# EAGLE schematic milliLearn-ice40 (EAGLE 9.5.1)

## Sheet 1 of 4
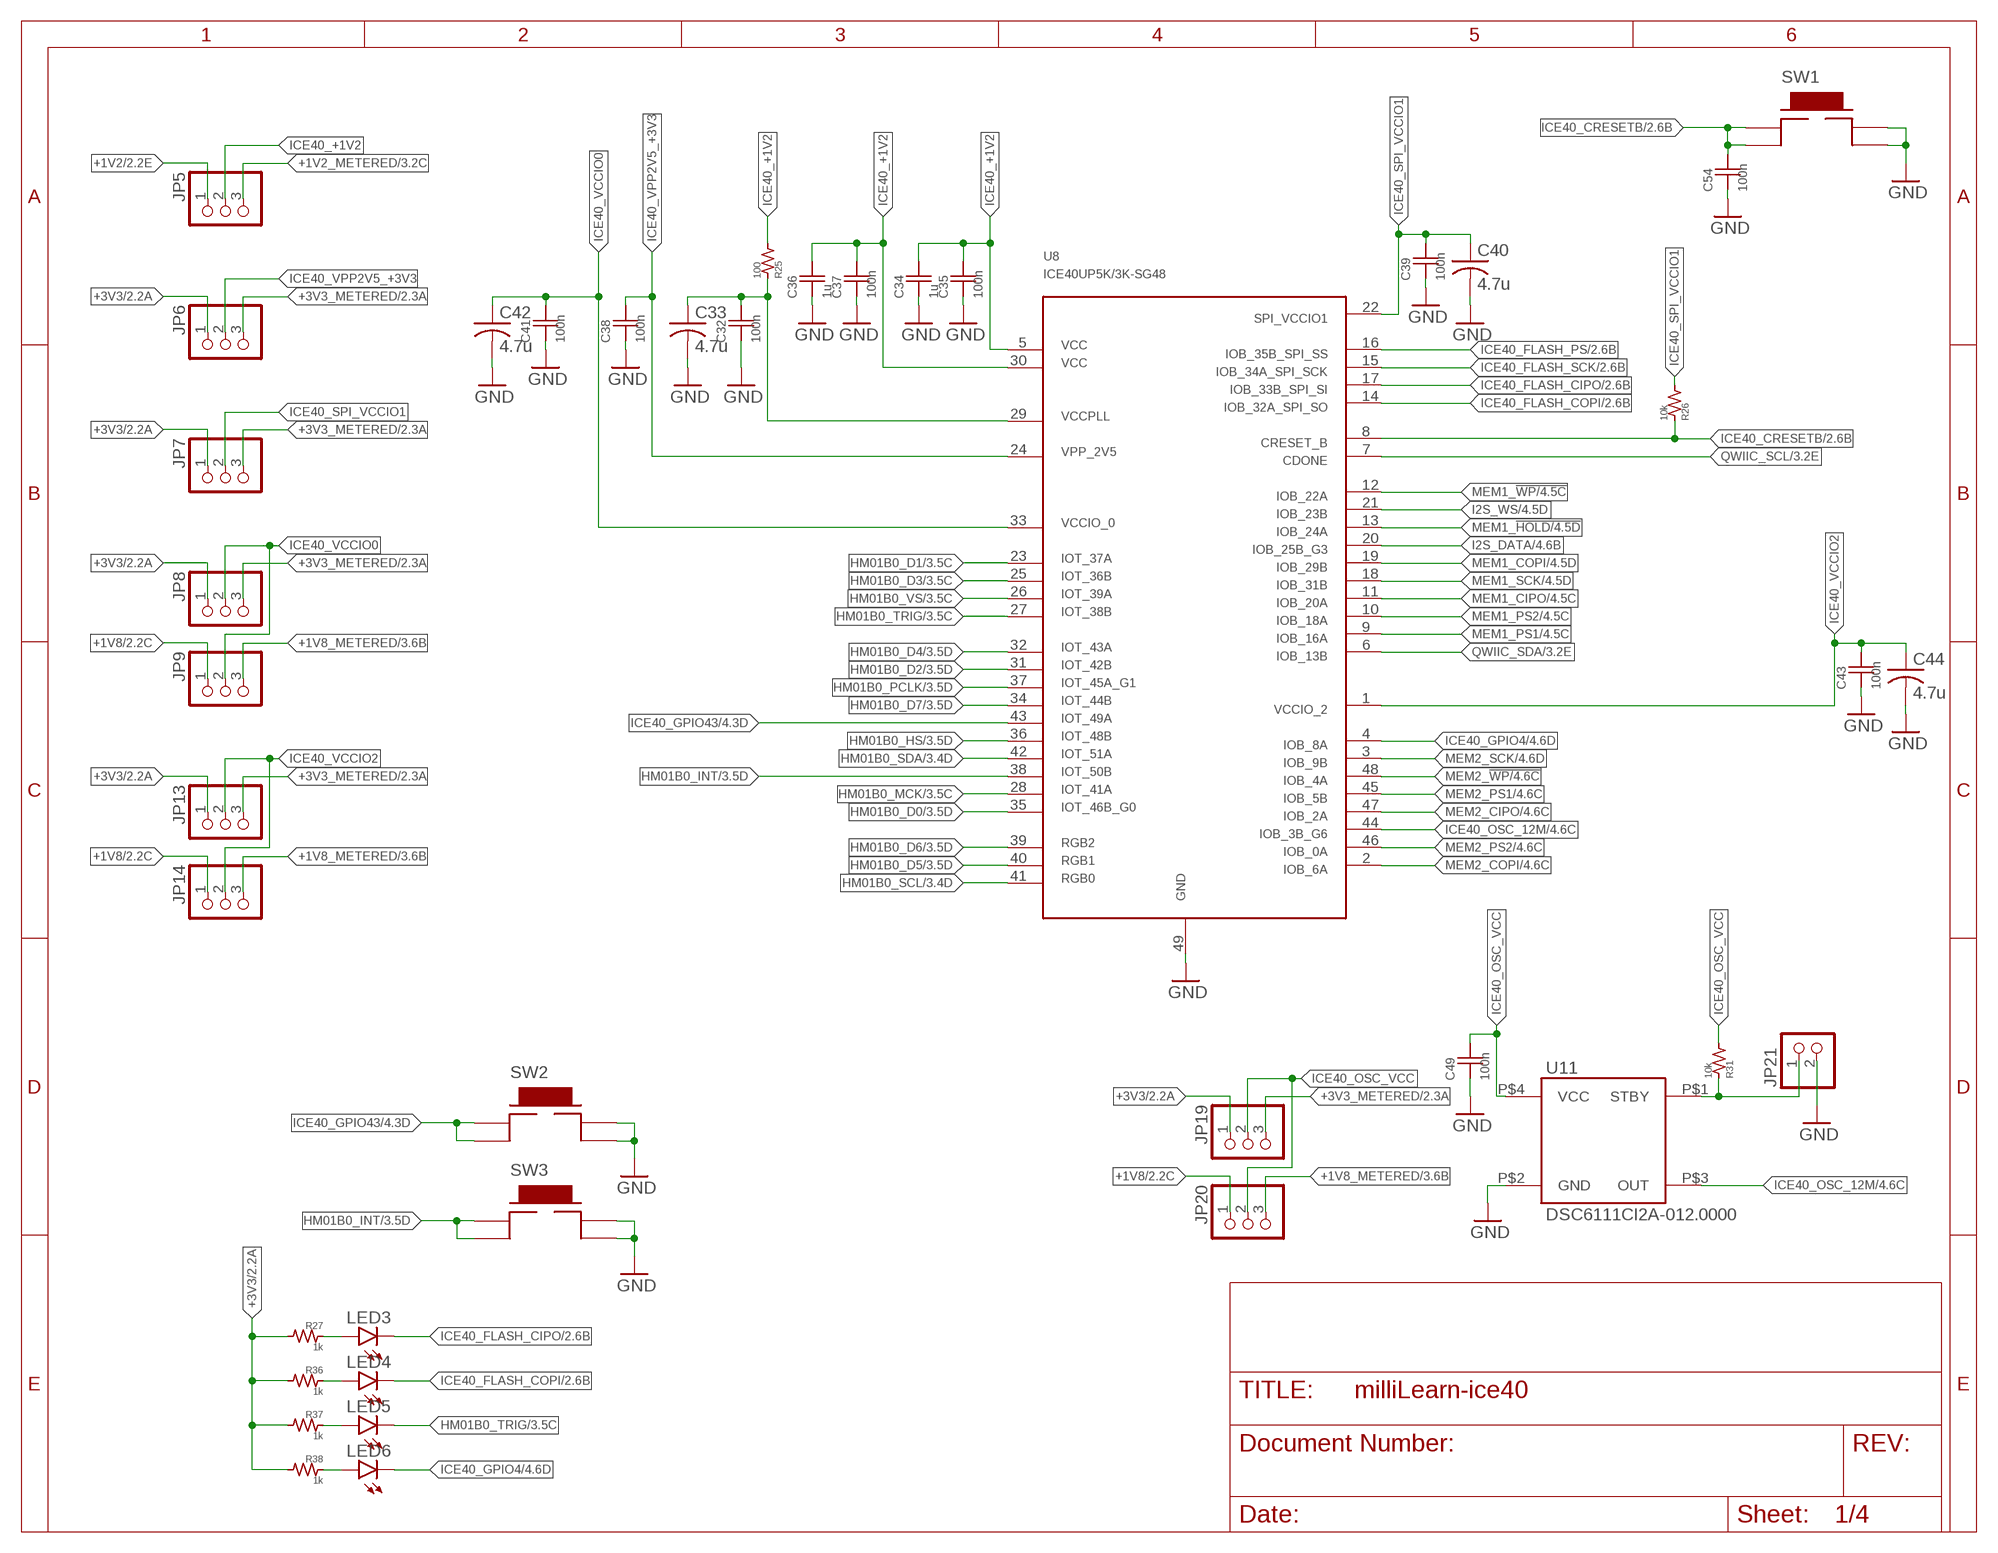
[diagram p0: schematic, sheet 1]

### Parts
C32  100n  C0402_COMPACT  [C0402_COMPACT]
C33  4.7u  C-USC0603  [C0603]
C34  1u  C0402_COMPACT  [C0402_COMPACT]
C35  100n  C0402_COMPACT  [C0402_COMPACT]
C36  1u  C0402_COMPACT  [C0402_COMPACT]
C37  100n  C0402_COMPACT  [C0402_COMPACT]
C38  100n  C0402_COMPACT  [C0402_COMPACT]
C39  100n  C0402_COMPACT  [C0402_COMPACT]
C40  4.7u  C-USC0603  [C0603]
C41  100n  C0402_COMPACT  [C0402_COMPACT]
C42  4.7u  C-USC0603  [C0603]
C43  100n  C0402_COMPACT  [C0402_COMPACT]
C44  4.7u  C-USC0603  [C0603]
C49  100n  C0402_COMPACT  [C0402_COMPACT]
C54  100n  C0402_COMPACT  [C0402_COMPACT]
JP5  PINHD-1X3  [1X03]
JP6  PINHD-1X3  [1X03]
JP7  PINHD-1X3  [1X03]
JP8  PINHD-1X3  [1X03]
JP9  PINHD-1X3  [1X03]
JP13  PINHD-1X3  [1X03]
JP14  PINHD-1X3  [1X03]
JP19  PINHD-1X3  [1X03]
JP20  PINHD-1X3  [1X03]
JP21  PINHD-1X2  [1X02]
LED3  LEDCHIPLED_0603  [CHIPLED_0603]
LED4  LEDCHIPLED_0603  [CHIPLED_0603]
LED5  LEDCHIPLED_0603  [CHIPLED_0603]
LED6  LEDCHIPLED_0603  [CHIPLED_0603]
R25  100  R0402_COMPACT  [R0402_COMPACT]
R26  10k  R0402_COMPACT  [R0402_COMPACT]
R27  1k  R0402_COMPACT  [R0402_COMPACT]
R31  10k  R0402_COMPACT  [R0402_COMPACT]
R36  1k  R0402_COMPACT  [R0402_COMPACT]
R37  1k  R0402_COMPACT  [R0402_COMPACT]
R38  1k  R0402_COMPACT  [R0402_COMPACT]
SW1  TE_FSMJSMA  [TE_FSMJSMA]
SW2  TE_FSMJSMA  [TE_FSMJSMA]
SW3  TE_FSMJSMA  [TE_FSMJSMA]
U8  ICE40UP5K/3K-SG48  [ICE40UP5K/3K-SG48]
U11  DSC6111CI2A-012.0000  [DSC6111CI2A-012.0000]

### Nets
+1V2: JP5.1 ; also sheet 2,3
+1V2_METERED: JP5.3 ; also sheet 3
+1V8: JP9.1 JP14.1 JP20.1 ; also sheet 2,3,4
+1V8_METERED: JP9.3 JP14.3 JP20.3 ; also sheet 3,4
+3V3: JP6.1 JP7.1 JP8.1 JP13.1 JP19.1 R27.1 R36.1 R37.1 R38.1 ; also sheet 2,3,4
+3V3_METERED: JP6.3 JP7.3 JP8.3 JP13.3 JP19.3 ; also sheet 2,3,4
GND: C32.1 C33.2 C34.1 C35.1 C36.1 C37.1 C38.1 C39.1 C40.2 C41.1 C42.2 C43.1 C44.2 C49.1 C54.1 JP21.2 SW1.P$3 SW1.P$4 SW2.P$3 SW2.P$4 SW3.P$3 SW3.P$4 U8.49 U11.P$2(GND) ; also sheet 2,3,4
HM01B0_D0: U8.35 ; also sheet 3,4
HM01B0_D1: U8.23 ; also sheet 3,4
HM01B0_D2: U8.31 ; also sheet 3,4
HM01B0_D3: U8.25 ; also sheet 3,4
HM01B0_D4: U8.32 ; also sheet 3,4
HM01B0_D5: U8.40 ; also sheet 3,4
HM01B0_D6: U8.39 ; also sheet 3,4
HM01B0_D7: U8.34 ; also sheet 3,4
HM01B0_HS: U8.36 ; also sheet 3,4
HM01B0_INT: SW3.P$1 SW3.P$2 U8.38 ; also sheet 3,4
HM01B0_MCK: U8.28 ; also sheet 3,4
HM01B0_PCLK: U8.37 ; also sheet 3,4
HM01B0_SCL: U8.41 ; also sheet 3,4
HM01B0_SDA: U8.42 ; also sheet 3,4
HM01B0_TRIG: LED5.C U8.27 ; also sheet 3,4
HM01B0_VS: U8.26 ; also sheet 3,4
I2S_DATA: U8.20 ; also sheet 4
I2S_WS: U8.21 ; also sheet 4
ICE40_+1V2: C34.2 C35.2 C36.2 C37.2 JP5.2 R25.1 U8.5 U8.30
ICE40_CRESETB: C54.2 R26.2 SW1.P$1 SW1.P$2 U8.8 ; also sheet 2
ICE40_FLASH_CIPO: LED3.C U8.17 ; also sheet 2,4
ICE40_FLASH_COPI: LED4.C U8.14 ; also sheet 2,4
ICE40_FLASH_PS: U8.16 ; also sheet 2,4
ICE40_FLASH_SCK: U8.15 ; also sheet 2,4
ICE40_GPIO4: LED6.C U8.4 ; also sheet 4
ICE40_GPIO43: SW2.P$1 SW2.P$2 U8.43 ; also sheet 4
ICE40_OSC_12M: U8.44 U11.P$3(OUT) ; also sheet 4
ICE40_OSC_VCC: C49.2 JP19.2 JP20.2 R31.1 U11.P$4(VCC)
ICE40_SPI_VCCIO1: C39.2 C40.1 JP7.2 R26.1 U8.22
ICE40_VCCIO0: C41.2 C42.1 JP8.2 JP9.2 U8.33
ICE40_VCCIO2: C43.2 C44.1 JP13.2 JP14.2 U8.1
ICE40_VCCPLL: C32.2 C33.1 R25.2 U8.29
ICE40_VPP2V5_+3V3: C38.2 JP6.2 U8.24
MEM1_!HOLD: U8.13 ; also sheet 4
MEM1_!WP: U8.12 ; also sheet 4
MEM1_CIPO: U8.11 ; also sheet 4
MEM1_COPI: U8.19 ; also sheet 4
MEM1_PS1: U8.9 ; also sheet 4
MEM1_PS2: U8.10 ; also sheet 4
MEM1_SCK: U8.18 ; also sheet 4
MEM2_!WP: U8.48 ; also sheet 4
MEM2_CIPO: U8.47 ; also sheet 4
MEM2_COPI: U8.2 ; also sheet 4
MEM2_PS1: U8.45 ; also sheet 4
MEM2_PS2: U8.46 ; also sheet 4
MEM2_SCK: U8.3 ; also sheet 4
N$30: JP21.1 R31.2 U11.P$1(STBY)
N$31: LED3.A R27.2
N$32: LED4.A R36.2
N$33: LED5.A R37.2
N$34: LED6.A R38.2
QWIIC_SCL: U8.7 ; also sheet 3,4
QWIIC_SDA: U8.6 ; also sheet 3,4

## Sheet 2 of 4
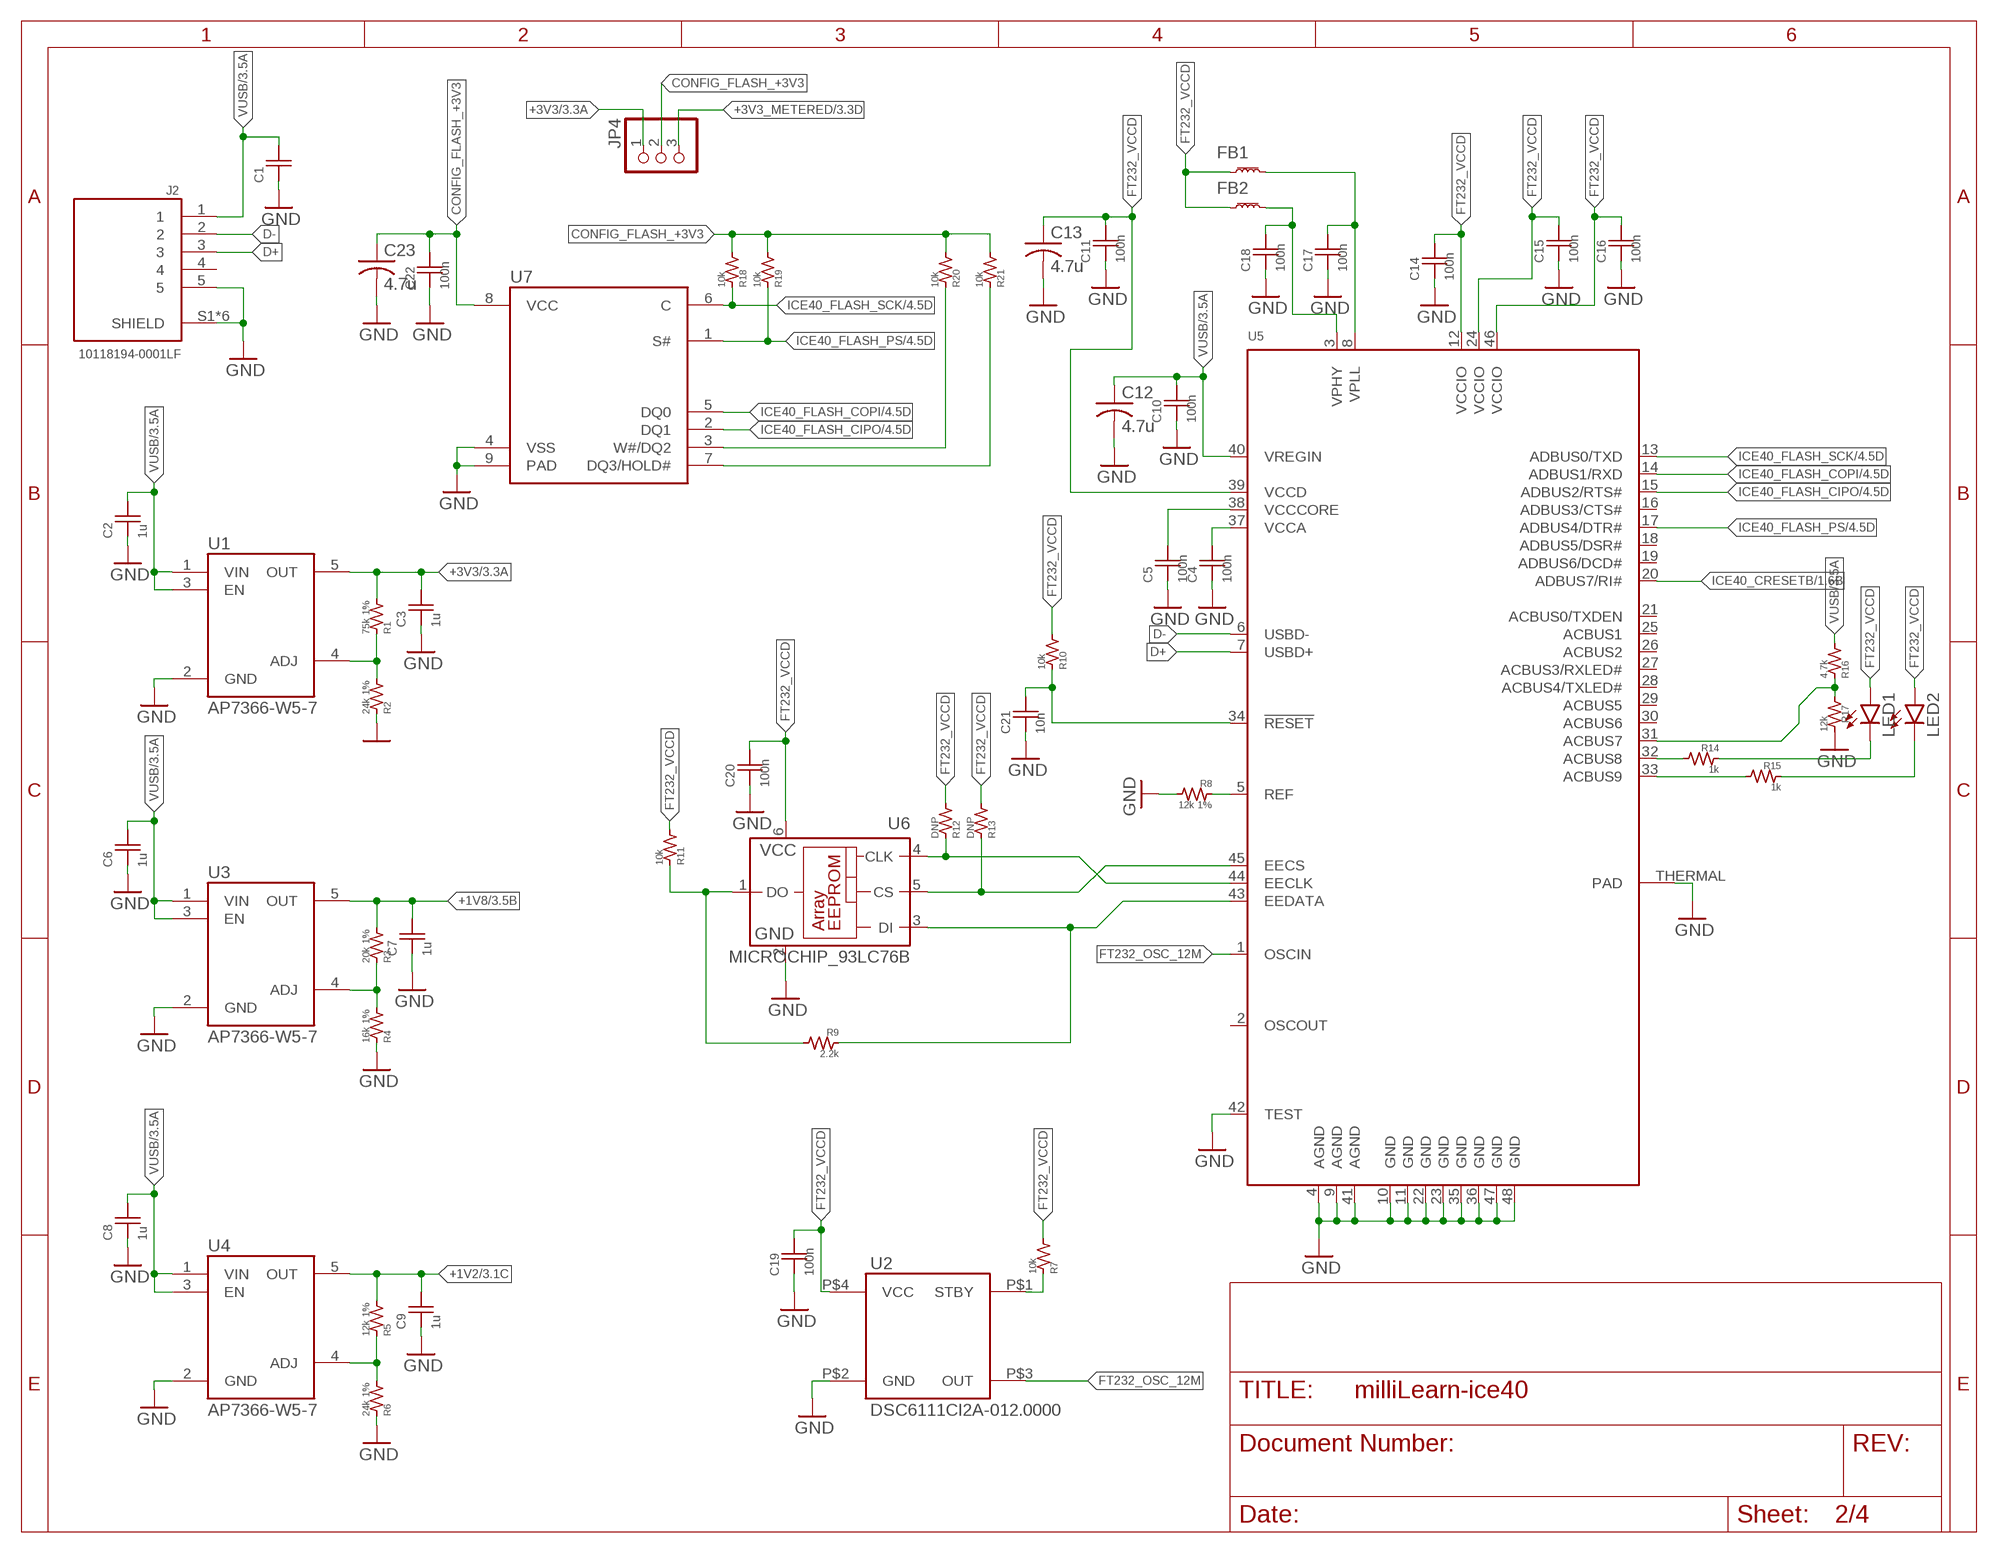
[diagram p1: schematic, sheet 2]

### Parts
C1  C0402_COMPACT  [C0402_COMPACT]
C2  1u  C0402_COMPACT  [C0402_COMPACT]
C3  1u  C0402_COMPACT  [C0402_COMPACT]
C4  100n  C0402_COMPACT  [C0402_COMPACT]
C5  100n  C0402_COMPACT  [C0402_COMPACT]
C6  1u  C0402_COMPACT  [C0402_COMPACT]
C7  1u  C0402_COMPACT  [C0402_COMPACT]
C8  1u  C0402_COMPACT  [C0402_COMPACT]
C9  1u  C0402_COMPACT  [C0402_COMPACT]
C10  100n  C0402_COMPACT  [C0402_COMPACT]
C11  100n  C0402_COMPACT  [C0402_COMPACT]
C12  4.7u  C-USC0603  [C0603]
C13  4.7u  C-USC0603  [C0603]
C14  100n  C0402_COMPACT  [C0402_COMPACT]
C15  100n  C0402_COMPACT  [C0402_COMPACT]
C16  100n  C0402_COMPACT  [C0402_COMPACT]
C17  100n  C0402_COMPACT  [C0402_COMPACT]
C18  100n  C0402_COMPACT  [C0402_COMPACT]
C19  100n  C0402_COMPACT  [C0402_COMPACT]
C20  100n  C0402_COMPACT  [C0402_COMPACT]
C21  10n  C0402_COMPACT  [C0402_COMPACT]
C22  100n  C0402_COMPACT  [C0402_COMPACT]
C23  4.7u  C-USC0603  [C0603]
FB1  BLM18KG601SN1D  [BLM18KG601SN1D]
FB2  BLM18KG601SN1D  [BLM18KG601SN1D]
J2  10118194-0001LF  [AMPHENOL_10118194-0001LF]
JP4  PINHD-1X3  [1X03]
LED1  LEDCHIPLED_0603  [CHIPLED_0603]
LED2  LEDCHIPLED_0603  [CHIPLED_0603]
R1  75k 1%  R0402_COMPACT  [R0402_COMPACT]
R2  24k 1%  R0402_COMPACT  [R0402_COMPACT]
R3  20k 1%  R0402_COMPACT  [R0402_COMPACT]
R4  16k 1%  R0402_COMPACT  [R0402_COMPACT]
R5  12k 1%  R0402_COMPACT  [R0402_COMPACT]
R6  24k 1%  R0402_COMPACT  [R0402_COMPACT]
R7  10k  R0402_COMPACT  [R0402_COMPACT]
R8  12k 1%  R0402_COMPACT  [R0402_COMPACT]
R9  2.2k  R0402_COMPACT  [R0402_COMPACT]
R10  10k  R0402_COMPACT  [R0402_COMPACT]
R11  10k  R0402_COMPACT  [R0402_COMPACT]
R12  DNP  R0402_COMPACT  [R0402_COMPACT]
R13  DNP  R0402_COMPACT  [R0402_COMPACT]
R14  1k  R0402_COMPACT  [R0402_COMPACT]
R15  1k  R0402_COMPACT  [R0402_COMPACT]
R16  4.7k  R0402_COMPACT  [R0402_COMPACT]
R17  12k  R0402_COMPACT  [R0402_COMPACT]
R18  10k  R0402_COMPACT  [R0402_COMPACT]
R19  10k  R0402_COMPACT  [R0402_COMPACT]
R20  10k  R0402_COMPACT  [R0402_COMPACT]
R21  10k  R0402_COMPACT  [R0402_COMPACT]
U1  AP7366-W5-7  [AP7366-W5-7]
U2  DSC6111CI2A-012.0000  [DSC6111CI2A-012.0000]
U3  AP7366-W5-7  [AP7366-W5-7]
U4  AP7366-W5-7  [AP7366-W5-7]
U5  MICROBUILDER_FT232HQ  [MICROBUILDER_QFN48_8MM]
U6  MICROCHIP_93LC76B  [MICROCHIP_SOT23-6]
U7  MT25QL128ABA1EW7  [MT25QL128ABA1EW7]

### Nets
+1V2: C9.2 R5.1 U4.5(OUT) ; also sheet 1,3
+1V8: C7.2 R3.1 U3.5(OUT) ; also sheet 1,3,4
+3V3: C3.2 JP4.1 R1.1 U1.5(OUT) ; also sheet 1,3,4
+3V3_METERED: JP4.3 ; also sheet 1,3,4
CONFIG_FLASH_+3V3: C22.2 C23.1 JP4.2 R18.1 R19.1 R20.1 R21.1 U7.8(VCC)
D+: J2.3 U5.7(USBD+)
D-: J2.2 U5.6(USBD-)
FT232_OSC_12M: U2.P$3(OUT) U5.1(OSCIN)
FT232_VCCD: C11.2 C13.1 C14.2 C15.2 C16.2 C19.2 C20.2 FB1.1 FB2.1 LED1.A LED2.A R7.1 R10.1 R11.1 R12.1 R13.1 U2.P$4(VCC) U5.12(VCCIO) U5.24(VCCIO) U5.39(VCCD) U5.46(VCCIO) U6.6(VCC)
GND: C1.1 C2.1 C3.1 C4.1 C5.1 C6.1 C7.1 C8.1 C9.1 C10.1 C11.1 C12.2 C13.2 C14.1 C15.1 C16.1 C17.1 C18.1 C19.1 C20.1 C21.1 C22.1 C23.2 J2.5 J2.S1(SHIELD) J2.S2(SHIELD) J2.S3(SHIELD) J2.S4(SHIELD) J2.S5(SHIELD) J2.S6(SHIELD) R2.2 R4.2 R6.2 R8.1 R17.2 U1.2(GND) U2.P$2(GND) U3.2(GND) U4.2(GND) U5.4(AGND) U5.9(AGND) U5.10(GND) U5.11(GND) U5.22(GND) U5.23(GND) U5.35(GND) U5.36(GND) U5.41(AGND) U5.42(TEST) U5.47(GND) U5.48(GND) U5.THERMAL(PAD) U6.2(GND) U7.4(VSS) U7.9(PAD) ; also sheet 1,3,4
ICE40_CRESETB: U5.20(ADBUS7/RI#) ; also sheet 1
ICE40_FLASH_CIPO: U5.15(ADBUS2/RTS#) U7.2(DQ1) ; also sheet 1,4
ICE40_FLASH_COPI: U5.14(ADBUS1/RXD) U7.5(DQ0) ; also sheet 1,4
ICE40_FLASH_PS: R19.2 U5.17(ADBUS4/DTR#) U7.1(S#) ; also sheet 1,4
ICE40_FLASH_SCK: R18.2 U5.13(ADBUS0/TXD) U7.6(C) ; also sheet 1,4
N$1: R5.2 R6.1 U4.4(ADJ)
N$2: R1.2 R2.1 U1.4(ADJ)
N$4: C18.2 FB2.2 U5.3(VPHY)
N$5: C17.2 FB1.2 U5.8(VPLL)
N$6: R3.2 R4.1 U3.4(ADJ)
N$7: R7.2 U2.P$1(STBY)
N$8: R9.1 R11.2 U6.1(DO)
N$9: R8.2 U5.5(REF)
N$10: R9.2 U5.43(EEDATA) U6.3(DI)
N$11: R13.2 U5.45(EECS) U6.5(CS)
N$12: R12.2 U5.44(EECLK) U6.4(CLK)
N$13: R14.1 U5.32(ACBUS8)
N$14: C21.2 R10.2 U5.34(!RESET)
N$15: LED1.C R14.2
N$16: R16.2 R17.1 U5.31(ACBUS7)
N$17: R15.1 U5.33(ACBUS9)
N$18: LED2.C R15.2
N$19: R20.2 U7.3(W#/DQ2)
N$20: R21.2 U7.7(DQ3/HOLD#)
VCCA: C4.2 U5.37(VCCA)
VCCCORE: C5.2 U5.38(VCCCORE)
VUSB: C1.2 C2.2 C6.2 C8.2 C10.2 C12.1 J2.1 R16.1 U1.1(VIN) U1.3(EN) U3.1(VIN) U3.3(EN) U4.1(VIN) U4.3(EN) U5.40(VREGIN) ; also sheet 3
Unconnected: J2.4 U5.2(OSCOUT) U5.16(ADBUS3/CTS#) U5.18(ADBUS5/DSR#) U5.19(ADBUS6/DCD#) U5.21(ACBUS0/TXDEN) U5.25(ACBUS1) U5.26(ACBUS2) U5.27(ACBUS3/RXLED#) U5.28(ACBUS4/TXLED#) U5.29(ACBUS5) U5.30(ACBUS6)

## Sheet 3 of 4
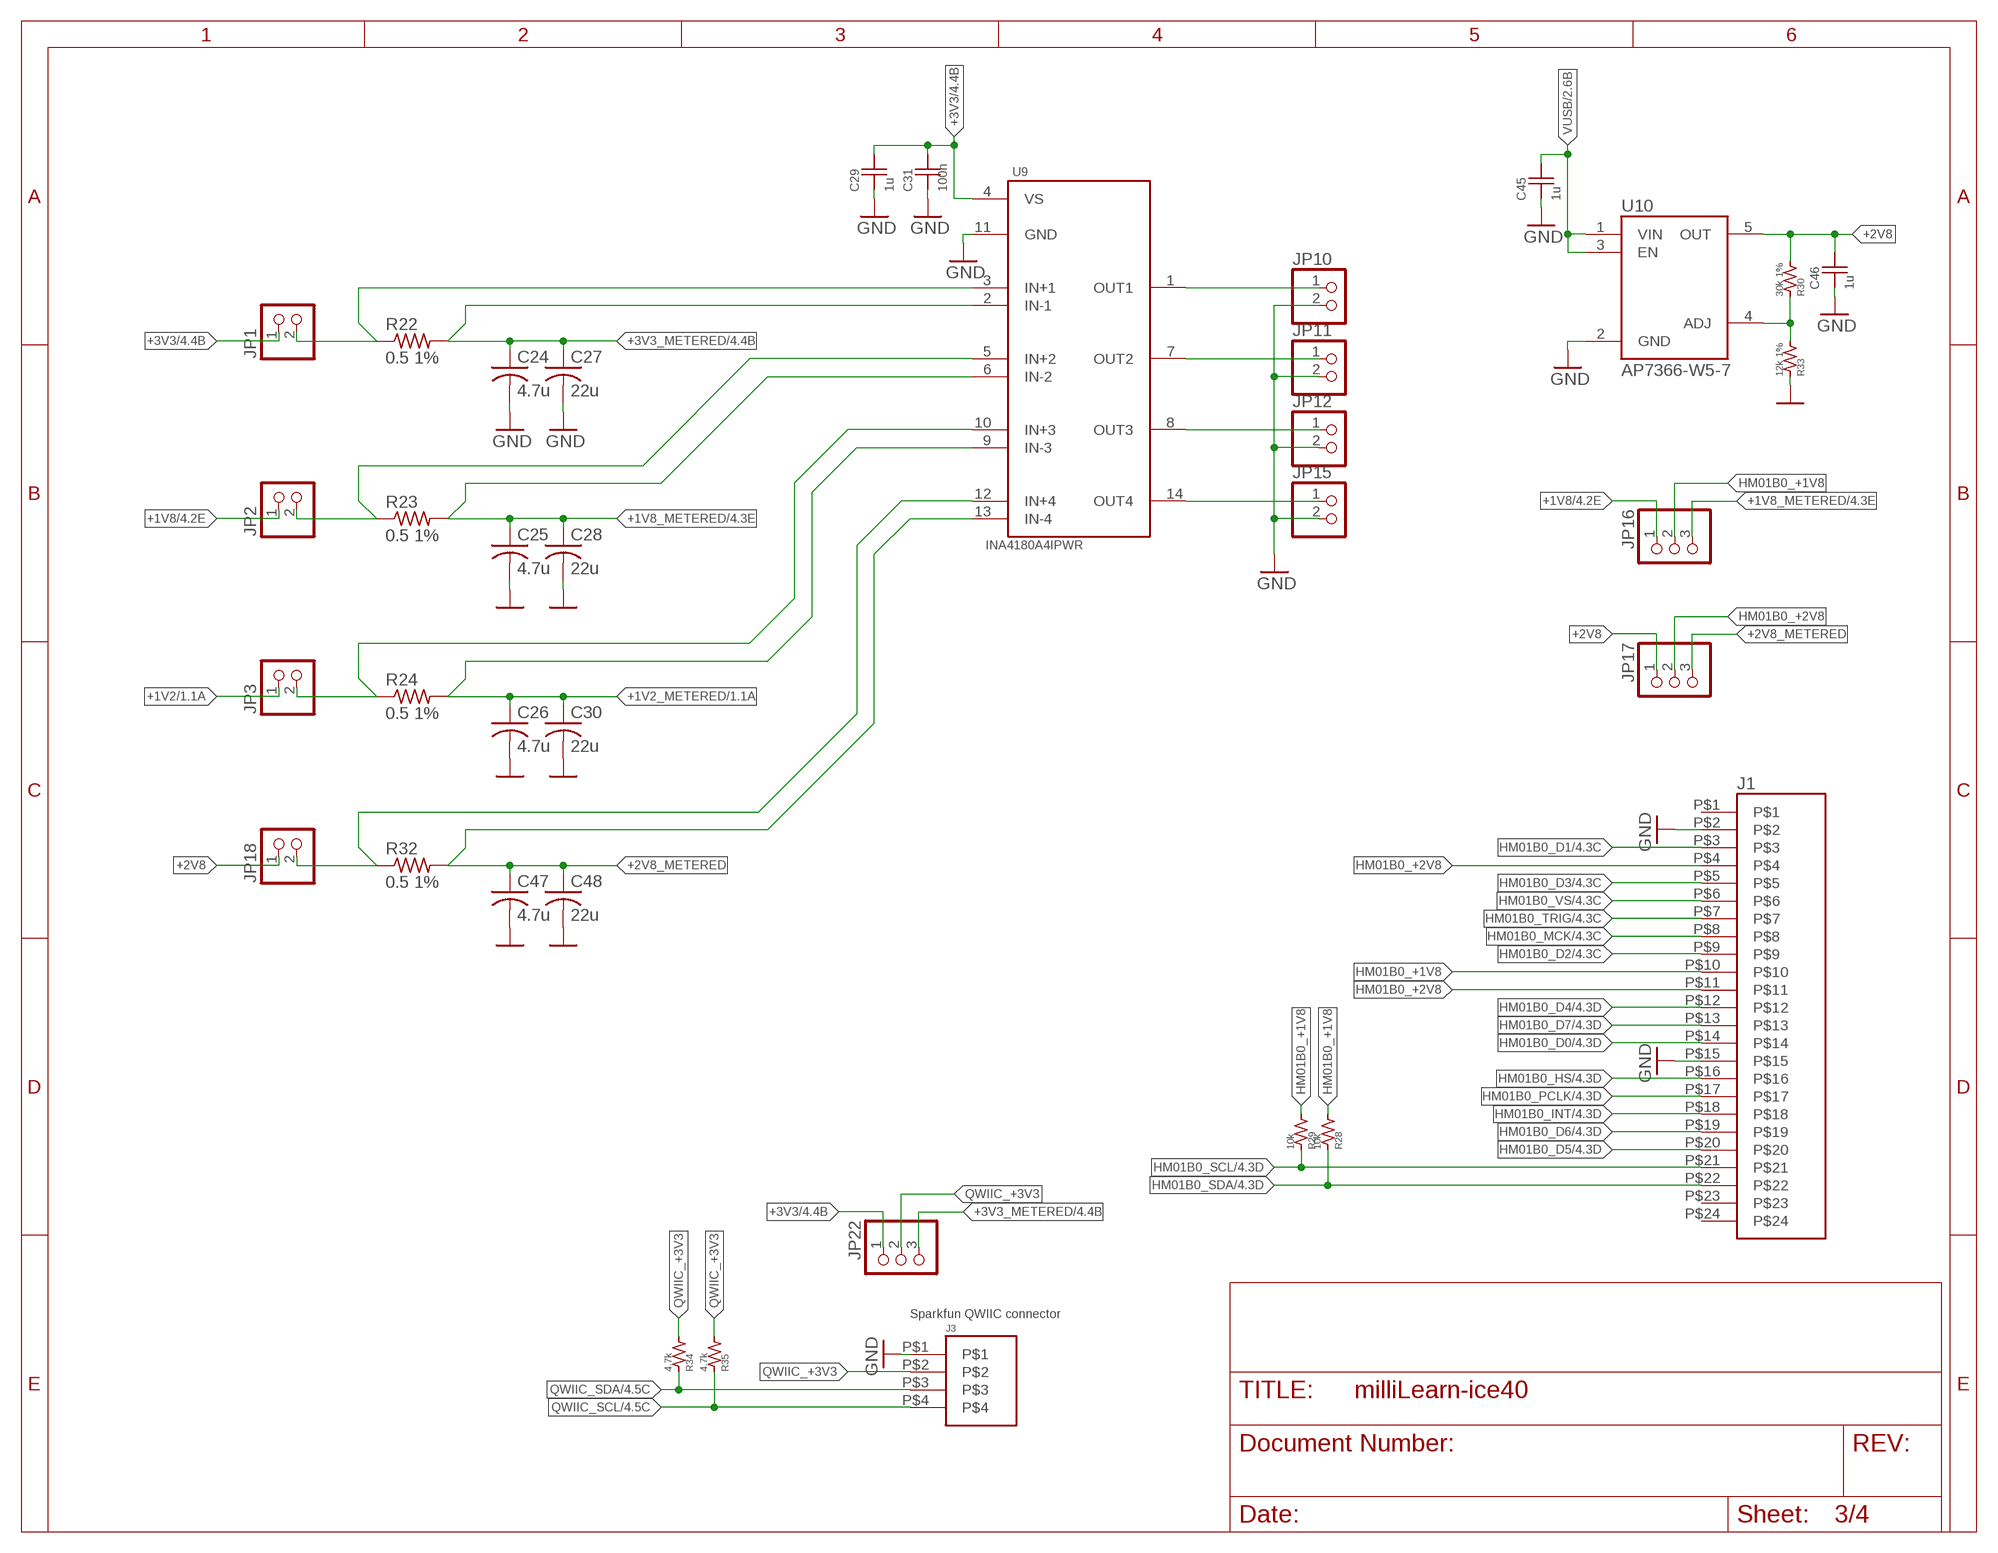
[diagram p2: schematic, sheet 3]

### Parts
C24  4.7u  C-USC0603  [C0603]
C25  4.7u  C-USC0603  [C0603]
C26  4.7u  C-USC0603  [C0603]
C27  22u  C-USC1210  [C1210]
C28  22u  C-USC1210  [C1210]
C29  1u  C0402_COMPACT  [C0402_COMPACT]
C30  22u  C-USC1210  [C1210]
C31  100n  C0402_COMPACT  [C0402_COMPACT]
C45  1u  C0402_COMPACT  [C0402_COMPACT]
C46  1u  C0402_COMPACT  [C0402_COMPACT]
C47  4.7u  C-USC0603  [C0603]
C48  22u  C-USC1210  [C1210]
J1  SFV24R-2STE1HLF  [SFV24R-2STE1HLF]
J3  SM04B-SRSS-TB(LF)(SN)  [SM04B-SRSS-TB(LF)(SN)]
JP1  PINHD-1X2  [1X02]
JP2  PINHD-1X2  [1X02]
JP3  PINHD-1X2  [1X02]
JP10  PINHD-1X2  [1X02]
JP11  PINHD-1X2  [1X02]
JP12  PINHD-1X2  [1X02]
JP15  PINHD-1X2  [1X02]
JP16  PINHD-1X3  [1X03]
JP17  PINHD-1X3  [1X03]
JP18  PINHD-1X2  [1X02]
JP22  PINHD-1X3  [1X03]
R22  0.5 1%  R-US_R0603  [R0603]
R23  0.5 1%  R-US_R0603  [R0603]
R24  0.5 1%  R-US_R0603  [R0603]
R28  10k  R0402_COMPACT  [R0402_COMPACT]
R29  10k  R0402_COMPACT  [R0402_COMPACT]
R30  30k 1%  R0402_COMPACT  [R0402_COMPACT]
R32  0.5 1%  R-US_R0603  [R0603]
R33  12k 1%  R0402_COMPACT  [R0402_COMPACT]
R34  4.7k  R0402_COMPACT  [R0402_COMPACT]
R35  4.7k  R0402_COMPACT  [R0402_COMPACT]
U9  INA4180A4IPWR  [INA4180A4IPWR]
U10  AP7366-W5-7  [AP7366-W5-7]

### Nets
+1V2: JP3.1 ; also sheet 1,2
+1V2_METERED: C26.1 C30.1 R24.2 U9.9(IN-3) ; also sheet 1
+1V8: JP2.1 JP16.1 ; also sheet 1,2,4
+1V8_METERED: C25.1 C28.1 JP16.3 R23.2 U9.6(IN-2) ; also sheet 1,4
+2V8: C46.2 JP17.1 JP18.1 R30.1 U10.5(OUT)
+2V8_METERED: C47.1 C48.1 JP17.3 R32.2 U9.13(IN-4)
+3V3: C29.2 C31.2 JP1.1 JP22.1 U9.4(VS) ; also sheet 1,2,4
+3V3_METERED: C24.1 C27.1 JP22.3 R22.2 U9.2(IN-1) ; also sheet 1,2,4
GND: C24.2 C25.2 C26.2 C27.2 C28.2 C29.1 C30.2 C31.1 C45.1 C46.1 C47.2 C48.2 J1.P$2 J1.P$15 J3.P$1 JP10.2 JP11.2 JP12.2 JP15.2 R33.2 U9.11(GND) U10.2(GND) ; also sheet 1,2,4
HM01B0_+1V8: J1.P$10 JP16.2 R28.1 R29.1
HM01B0_+2V8: J1.P$4 J1.P$11 JP17.2
HM01B0_D0: J1.P$14 ; also sheet 1,4
HM01B0_D1: J1.P$3 ; also sheet 1,4
HM01B0_D2: J1.P$9 ; also sheet 1,4
HM01B0_D3: J1.P$5 ; also sheet 1,4
HM01B0_D4: J1.P$12 ; also sheet 1,4
HM01B0_D5: J1.P$20 ; also sheet 1,4
HM01B0_D6: J1.P$19 ; also sheet 1,4
HM01B0_D7: J1.P$13 ; also sheet 1,4
HM01B0_HS: J1.P$16 ; also sheet 1,4
HM01B0_INT: J1.P$18 ; also sheet 1,4
HM01B0_MCK: J1.P$8 ; also sheet 1,4
HM01B0_PCLK: J1.P$17 ; also sheet 1,4
HM01B0_SCL: J1.P$21 R29.2 ; also sheet 1,4
HM01B0_SDA: J1.P$22 R28.2 ; also sheet 1,4
HM01B0_TRIG: J1.P$7 ; also sheet 1,4
HM01B0_VS: J1.P$6 ; also sheet 1,4
N$3: JP1.2 R22.1 U9.3(IN+1)
N$21: JP2.2 R23.1 U9.5(IN+2)
N$22: JP3.2 R24.1 U9.10(IN+3)
N$23: JP10.1 U9.1(OUT1)
N$24: JP11.1 U9.7(OUT2)
N$25: JP12.1 U9.8(OUT3)
N$26: JP15.1 U9.14(OUT4)
N$28: R30.2 R33.1 U10.4(ADJ)
N$29: JP18.2 R32.1 U9.12(IN+4)
QWIIC_+3V3: J3.P$2 JP22.2 R34.1 R35.1
QWIIC_SCL: J3.P$4 R35.2 ; also sheet 1,4
QWIIC_SDA: J3.P$3 R34.2 ; also sheet 1,4
VUSB: C45.2 U10.1(VIN) U10.3(EN) ; also sheet 2
Unconnected: J1.P$1 J1.P$23 J1.P$24

### Notes on the sheet
- Sparkfun QWIIC connector

## Sheet 4 of 4
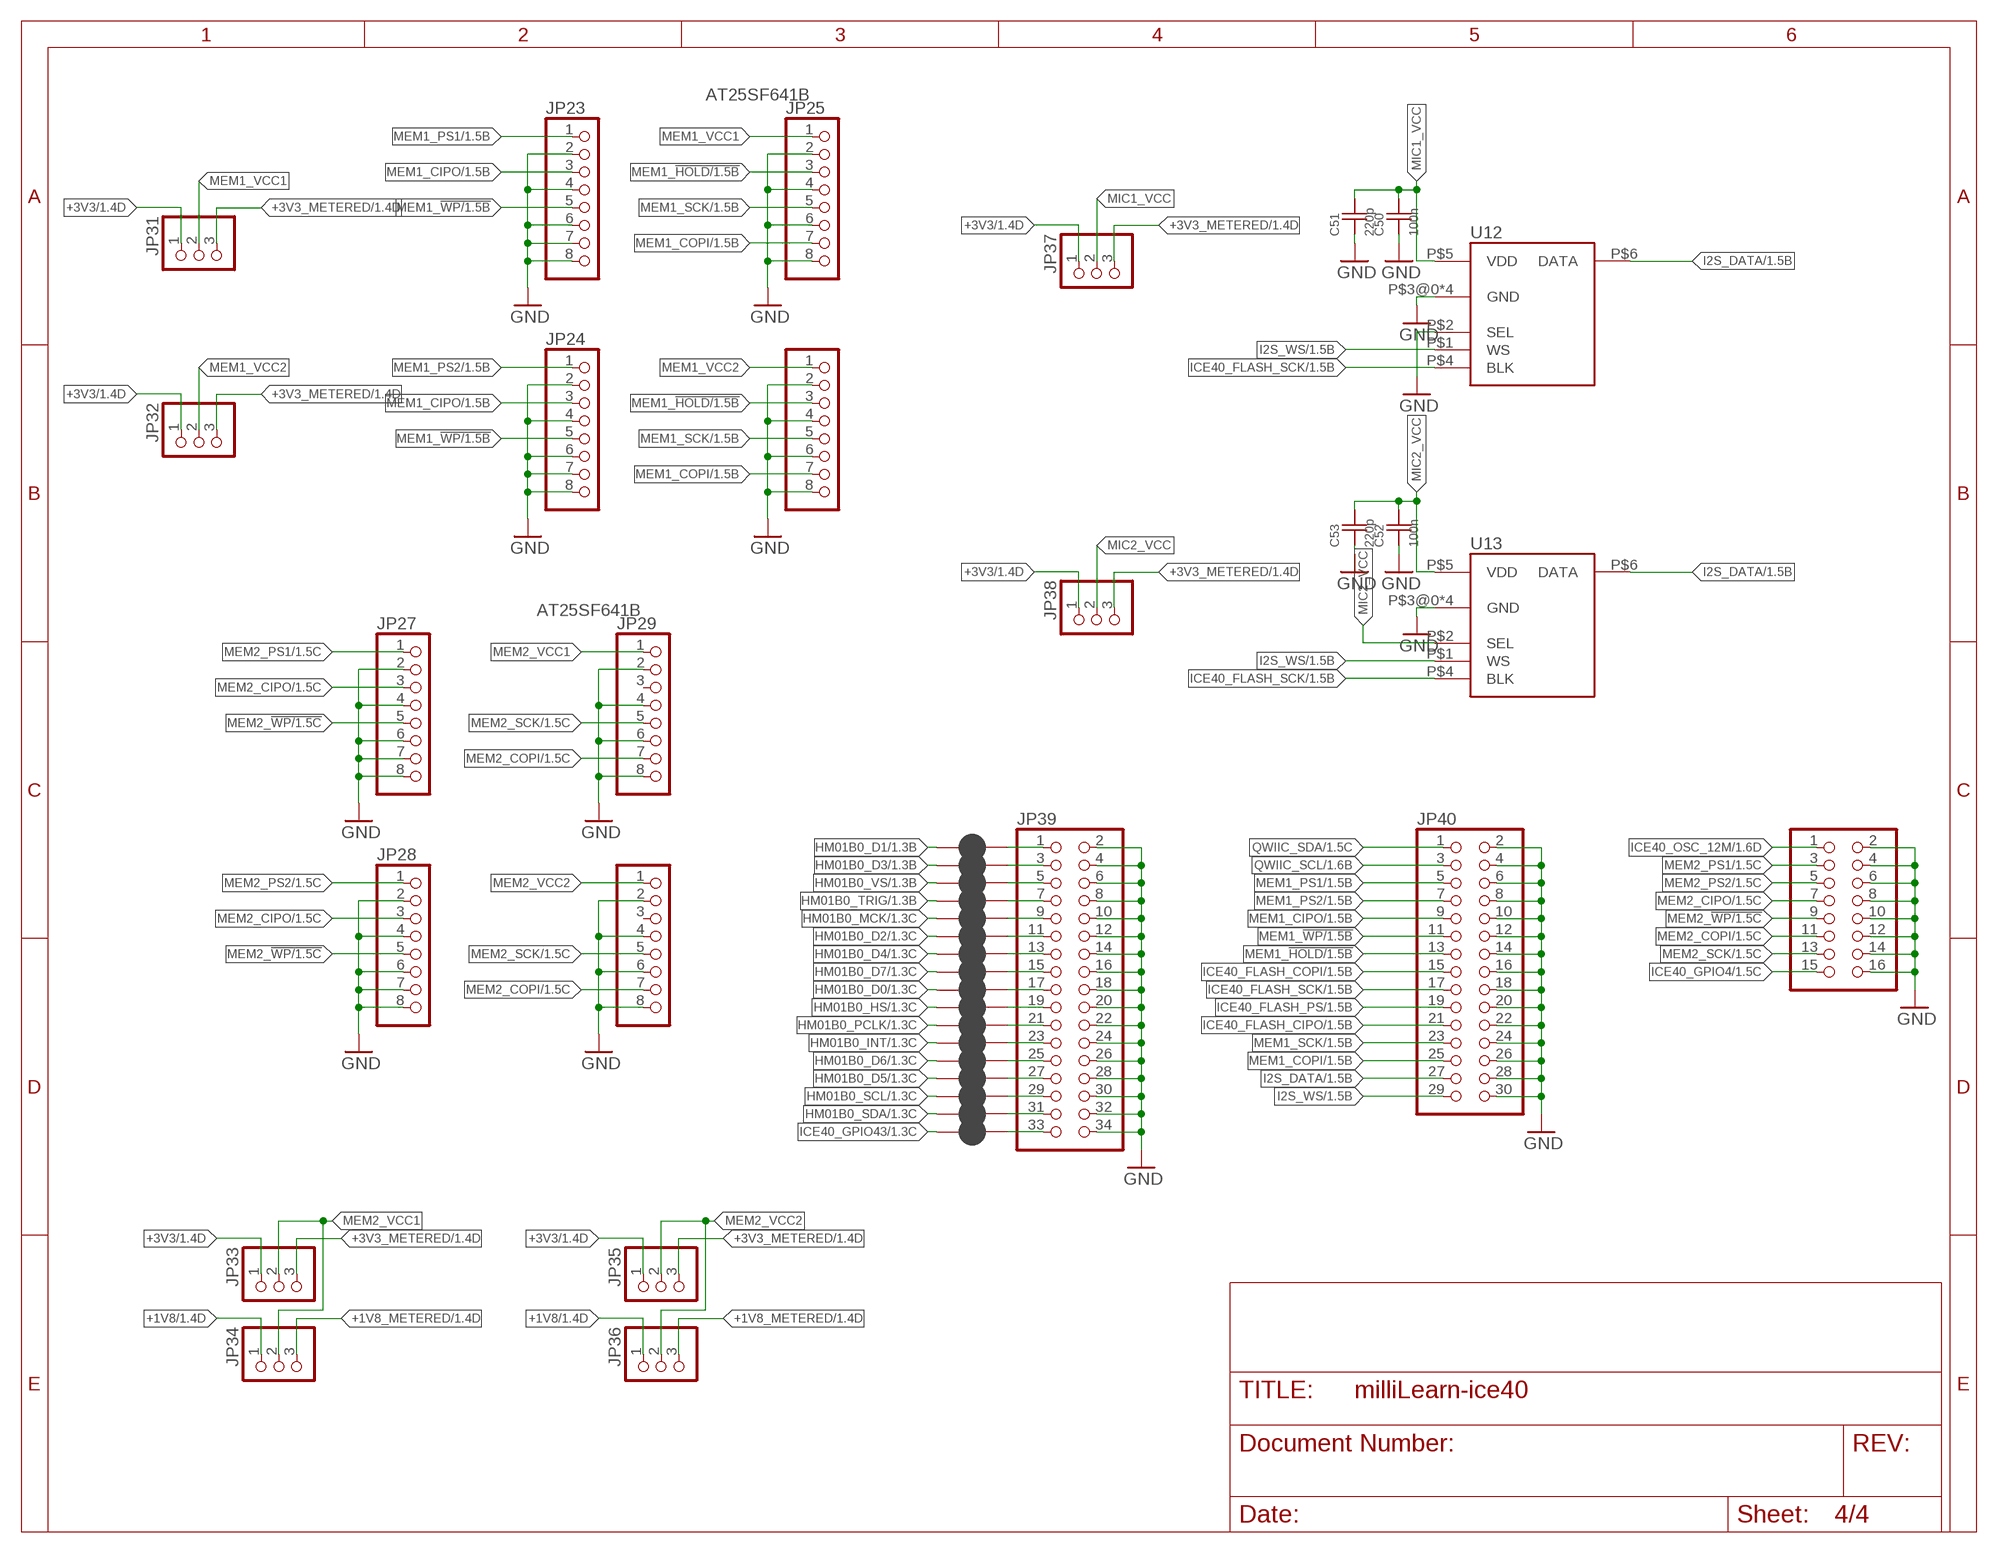
[diagram p3: schematic, sheet 4]

### Parts
C50  100n  C0402_COMPACT  [C0402_COMPACT]
C51  220p  C0402_COMPACT  [C0402_COMPACT]
C52  100n  C0402_COMPACT  [C0402_COMPACT]
C53  220p  C0402_COMPACT  [C0402_COMPACT]
JP23  PINHD-1X8  [1X08]
JP24  PINHD-1X8  [1X08]
JP25  PINHD-1X8  [1X08]
JP26  PINHD-1X8  [1X08]
JP27  PINHD-1X8  [1X08]
JP28  PINHD-1X8  [1X08]
JP29  PINHD-1X8  [1X08]
JP30  PINHD-1X8  [1X08]
JP31  PINHD-1X3  [1X03]
JP32  PINHD-1X3  [1X03]
JP33  PINHD-1X3  [1X03]
JP34  PINHD-1X3  [1X03]
JP35  PINHD-1X3  [1X03]
JP36  PINHD-1X3  [1X03]
JP37  PINHD-1X3  [1X03]
JP38  PINHD-1X3  [1X03]
JP39  PINHD-2X17  [2X17]
JP40  PINHD-2X15  [2X15]
JP41  PINHD-2X8  [2X08]
SJ1  JUMPER-SMT_2_NC_PASTE_NO-SILK  [SMT-JUMPER_2_NC_PASTE_NO-SILK]
SJ2  JUMPER-SMT_2_NC_PASTE_NO-SILK  [SMT-JUMPER_2_NC_PASTE_NO-SILK]
SJ3  JUMPER-SMT_2_NC_PASTE_NO-SILK  [SMT-JUMPER_2_NC_PASTE_NO-SILK]
SJ4  JUMPER-SMT_2_NC_PASTE_NO-SILK  [SMT-JUMPER_2_NC_PASTE_NO-SILK]
SJ5  JUMPER-SMT_2_NC_PASTE_NO-SILK  [SMT-JUMPER_2_NC_PASTE_NO-SILK]
SJ6  JUMPER-SMT_2_NC_PASTE_NO-SILK  [SMT-JUMPER_2_NC_PASTE_NO-SILK]
SJ7  JUMPER-SMT_2_NC_PASTE_NO-SILK  [SMT-JUMPER_2_NC_PASTE_NO-SILK]
SJ8  JUMPER-SMT_2_NC_PASTE_NO-SILK  [SMT-JUMPER_2_NC_PASTE_NO-SILK]
SJ9  JUMPER-SMT_2_NC_PASTE_NO-SILK  [SMT-JUMPER_2_NC_PASTE_NO-SILK]
SJ10  JUMPER-SMT_2_NC_PASTE_NO-SILK  [SMT-JUMPER_2_NC_PASTE_NO-SILK]
SJ11  JUMPER-SMT_2_NC_PASTE_NO-SILK  [SMT-JUMPER_2_NC_PASTE_NO-SILK]
SJ12  JUMPER-SMT_2_NC_PASTE_NO-SILK  [SMT-JUMPER_2_NC_PASTE_NO-SILK]
SJ13  JUMPER-SMT_2_NC_PASTE_NO-SILK  [SMT-JUMPER_2_NC_PASTE_NO-SILK]
SJ14  JUMPER-SMT_2_NC_PASTE_NO-SILK  [SMT-JUMPER_2_NC_PASTE_NO-SILK]
SJ15  JUMPER-SMT_2_NC_PASTE_NO-SILK  [SMT-JUMPER_2_NC_PASTE_NO-SILK]
SJ16  JUMPER-SMT_2_NC_PASTE_NO-SILK  [SMT-JUMPER_2_NC_PASTE_NO-SILK]
SJ17  JUMPER-SMT_2_NC_PASTE_NO-SILK  [SMT-JUMPER_2_NC_PASTE_NO-SILK]
U12  SPH0645LM4H-B  [SPH0645LM4H-B]
U13  SPH0645LM4H-B  [SPH0645LM4H-B]

### Nets
+1V8: JP34.1 JP36.1 ; also sheet 1,2,3
+1V8_METERED: JP34.3 JP36.3 ; also sheet 1,3
+3V3: JP31.1 JP32.1 JP33.1 JP35.1 JP37.1 JP38.1 ; also sheet 1,2,3
+3V3_METERED: JP31.3 JP32.3 JP33.3 JP35.3 JP37.3 JP38.3 ; also sheet 1,2,3
GND: C50.1 C51.1 C52.1 C53.1 JP23.2 JP23.4 JP23.6 JP23.7 JP23.8 JP24.2 JP24.4 JP24.6 JP24.7 JP24.8 JP25.2 JP25.4 JP25.6 JP25.8 JP26.2 JP26.4 JP26.6 JP26.8 JP27.2 JP27.4 JP27.6 JP27.7 JP27.8 JP28.2 JP28.4 JP28.6 JP28.7 JP28.8 JP29.2 JP29.4 JP29.6 JP29.8 JP30.2 JP30.4 JP30.6 JP30.8 JP39.2 JP39.4 JP39.6 JP39.8 JP39.10 JP39.12 JP39.14 JP39.16 JP39.18 JP39.20 JP39.22 JP39.24 JP39.26 JP39.28 JP39.30 JP39.32 JP39.34 JP40.2 JP40.4 JP40.6 JP40.8 JP40.10 JP40.12 JP40.14 JP40.16 JP40.18 JP40.20 JP40.22 JP40.24 JP40.26 JP40.28 JP40.30 JP41.2 JP41.4 JP41.6 JP41.8 JP41.10 JP41.12 JP41.14 JP41.16 U12.P$2(SEL) U12.P$3@0(GND) U12.P$3@1(GND) U12.P$3@2(GND) U12.P$3@3(GND) U13.P$3@0(GND) U13.P$3@1(GND) U13.P$3@2(GND) U13.P$3@3(GND) ; also sheet 1,2,3
HM01B0_D0: SJ9.1 ; also sheet 1,3
HM01B0_D1: SJ1.1 ; also sheet 1,3
HM01B0_D2: SJ6.1 ; also sheet 1,3
HM01B0_D3: SJ2.1 ; also sheet 1,3
HM01B0_D4: SJ7.1 ; also sheet 1,3
HM01B0_D5: SJ14.1 ; also sheet 1,3
HM01B0_D6: SJ13.1 ; also sheet 1,3
HM01B0_D7: SJ8.1 ; also sheet 1,3
HM01B0_HS: SJ10.1 ; also sheet 1,3
HM01B0_INT: SJ12.1 ; also sheet 1,3
HM01B0_MCK: SJ5.1 ; also sheet 1,3
HM01B0_PCLK: SJ11.1 ; also sheet 1,3
HM01B0_SCL: SJ15.1 ; also sheet 1,3
HM01B0_SDA: SJ16.1 ; also sheet 1,3
HM01B0_TRIG: SJ4.1 ; also sheet 1,3
HM01B0_VS: SJ3.1 ; also sheet 1,3
I2S_DATA: JP40.27 U12.P$6(DATA) U13.P$6(DATA) ; also sheet 1
I2S_WS: JP40.29 U12.P$1(WS) U13.P$1(WS) ; also sheet 1
ICE40_FLASH_CIPO: JP40.21 ; also sheet 1,2
ICE40_FLASH_COPI: JP40.15 ; also sheet 1,2
ICE40_FLASH_PS: JP40.19 ; also sheet 1,2
ICE40_FLASH_SCK: JP40.17 U12.P$4(BLK) U13.P$4(BLK) ; also sheet 1,2
ICE40_GPIO4: JP41.15 ; also sheet 1
ICE40_GPIO43: SJ17.1 ; also sheet 1
ICE40_OSC_12M: JP41.1 ; also sheet 1
MEM1_!HOLD: JP25.3 JP26.3 JP40.13 ; also sheet 1
MEM1_!WP: JP23.5 JP24.5 JP40.11 ; also sheet 1
MEM1_CIPO: JP23.3 JP24.3 JP40.9 ; also sheet 1
MEM1_COPI: JP25.7 JP26.7 JP40.25 ; also sheet 1
MEM1_PS1: JP23.1 JP40.5 ; also sheet 1
MEM1_PS2: JP24.1 JP40.7 ; also sheet 1
MEM1_SCK: JP25.5 JP26.5 JP40.23 ; also sheet 1
MEM1_VCC1: JP25.1 JP31.2
MEM1_VCC2: JP26.1 JP32.2
MEM2_!WP: JP27.5 JP28.5 JP41.9 ; also sheet 1
MEM2_CIPO: JP27.3 JP28.3 JP41.7 ; also sheet 1
MEM2_COPI: JP29.7 JP30.7 JP41.11 ; also sheet 1
MEM2_PS1: JP27.1 JP41.3 ; also sheet 1
MEM2_PS2: JP28.1 JP41.5 ; also sheet 1
MEM2_SCK: JP29.5 JP30.5 JP41.13 ; also sheet 1
MEM2_VCC1: JP29.1 JP33.2 JP34.2
MEM2_VCC2: JP30.1 JP35.2 JP36.2
MIC1_VCC: C50.2 C51.2 JP37.2 U12.P$5(VDD)
MIC2_VCC: C52.2 C53.2 JP38.2 U13.P$2(SEL) U13.P$5(VDD)
N$35: JP39.1 SJ1.2
N$36: JP39.3 SJ2.2
N$37: JP39.5 SJ3.2
N$38: JP39.7 SJ4.2
N$39: JP39.9 SJ5.2
N$40: JP39.11 SJ6.2
N$41: JP39.13 SJ7.2
N$42: JP39.15 SJ8.2
N$43: JP39.17 SJ9.2
N$44: JP39.19 SJ10.2
N$45: JP39.21 SJ11.2
N$46: JP39.23 SJ12.2
N$47: JP39.25 SJ13.2
N$48: JP39.27 SJ14.2
N$49: JP39.29 SJ15.2
N$50: JP39.31 SJ16.2
N$51: JP39.33 SJ17.2
QWIIC_SCL: JP40.3 ; also sheet 1,3
QWIIC_SDA: JP40.1 ; also sheet 1,3
Unconnected: JP29.3 JP30.3

### Notes on the sheet
- AT25SF641B
- AT25SF641B

## Library data of the parts
C1 C32 C38 = milliLearn-ice40:C0402_COMPACT
C2 C3 C6-C9 C29 C34 C36 C45 C46 = milliLearn-ice40:C0402_COMPACT; MFR: SAMSUNG; MFR_PN: CL05A105KO5NNNC
C4 C5 C10 C11 C14-C20 C22 C31 C35 C37 C39 C41 C43 C49 C50 C52 C54 = milliLearn-ice40:C0402_COMPACT; MFR: SAMSUNG; MFR_PN: CL05B104KO5NNNC
C12 C13 C23-C26 C33 C40 C42 C44 C47 = rcl:C-US: CAPACITOR, American symbol; MFR: SAMSUNG; MFR_PN: CL10A475KA8NQNC; SPICEPREFIX: C
C21 = milliLearn-ice40:C0402_COMPACT; MFR: SAMSUNG; MFR_PN: CL05B103KO5NNNC
C27 C28 C30 C48 = rcl:C-US: CAPACITOR, American symbol; MFR: AVX CORPORATION; MFR_PN: 12103C226KAT2A; SPICEPREFIX: C
C51 C53 = milliLearn-ice40:C0402_COMPACT; MFR: SAMSUNG; MFR_PN: CL05B221KB5NNNC
FB1 FB2 = milliLearn-ice40:BLM18KG601SN1D; MFR: MURATA; MFR_PN: BLM18KG601SN1D
J1 = milliLearn-ice40:SFV24R-2STE1HLF
J2 = milliLearn-ice40:10118194-0001LF: Micro Usb, 2.0 Type b, Rcpt, Smt; AVAILABILITY: Unavailable; DESCRIPTION: Micro Usb, 2.0 Type b, Rcpt, Smt; MF: Amphenol ICC; MP: 10118194-0001LF; PACKAGE: None; PRICE: None
J3 = milliLearn-ice40:SM04B-SRSS-TB(LF)(SN)
JP1-JP3 JP10-JP12 JP15 JP18 = pinhead:PINHD-1X2: PIN HEADER; MFR: WURTH ELECTRONIK; MFR_PN: 61300211121
JP4-JP9 JP13 JP14 JP16 JP17 JP19 JP20 JP22 JP31-JP38 = pinhead:PINHD-1X3: PIN HEADER
JP21 = pinhead:PINHD-1X2: PIN HEADER
JP23-JP30 = pinhead:PINHD-1X8: PIN HEADER
JP39 = pinhead:PINHD-2X17: PIN HEADER
JP40 = pinhead:PINHD-2X15: PIN HEADER
JP41 = pinhead:PINHD-2X8: PIN HEADER
LED1-LED6 = led:LED: LED OSRAM: - CHIPLED LG R971, LG N971, LY N971, LG Q971, LY Q971, LO R971, LY R971 LH N974, LH R974 LS Q976, LO Q976, LY Q976 LO Q996 - Hyper CHIPLED LW Q18S LB Q993, LB Q99A, LB R99A - SideLED LS A670, LO A670, LY A670, LG A670, LP A670 LB A673, LV A673, LT A673, LW A673 LH A674 LY A675 LS A676, LA A676, LO A676, LY A676, LW A676 LS A679, LY A679, LG A679 - Hyper Micro SIDELED® LS Y876, LA Y876, LO Y876, LY Y876 LT Y87S - SmartLED LW L88C, LW L88S LB L89C, LB L89S, LG L890 LS L89K, LO L89K, LY L89K LS L896, LA L896, LO L896, LY L896 - TOPLED LS T670, LO T670, LY T670, LG T670, LP T670 LSG T670, LSP T670, LSY T670, LOP T670, LYG T670 LG T671, LOG T671, LSG T671 LB T673, LV T673, LT T673, LW T673 LH T674 LS T676, LA T676, LO T676, LY T676, LB T676, LH T676, LSB T676, LW T676 LB T67C, LV T67C, LT T67C, LS T67K, LO T67K, LY T67K, LW E67C LS E67B, LA E67B, LO E67B, LY E67B, LB E67C, LV E67C, LT E67C LW T67C LS T679, LY T679, LG T679 LS T770, LO T770, LY T770, LG T770, LP T770 LB T773, LV T773, LT T773, LW T773 LH T774 LS E675, LA E675, LY E675, LS T675 LS T776, LA T776, LO T776, LY T776, LB T776 LHGB T686 LT T68C, LB T68C - Hyper Mini TOPLED® LB M676 - Mini TOPLED Santana® LG M470 LS M47K, LO M47K, LY M47K Source: http://www.osram.convergy.de LUXEON: - LUMILED® LXK2-PW12-R00, LXK2-PW12-S00, LXK2-PW14-U00, LXK2-PW14-V00 LXK2-PM12-R00, LXK2-PM12-S00, LXK2-PM14-U00 LXK2-PE12-Q00, LXK2-PE12-R00, LXK2-PE12-S00, LXK2-PE14-T00, LXK2-PE14-U00 LXK2-PB12-K00, LXK2-PB12-L00, LXK2-PB12-M00, LXK2-PB14-N00, LXK2-PB14-P00, LXK2-PB14-Q00 LXK2-PR12-L00, LXK2-PR12-M00, LXK2-PR14-Q00, LXK2-PR14-R00 LXK2-PD12-Q00, LXK2-PD12-R00, LXK2-PD12-S00 LXK2-PH12-R00, LXK2-PH12-S00 LXK2-PL12-P00, LXK2-PL12-Q00, LXK2-PL12-R00 Source: www.luxeon.com KINGBRIGHT: KA-3528ASYC Source: www.kingbright.com; MFR: LITE-ON; MFR_PN: LTST-C191KRKT
R1 = milliLearn-ice40:R0402_COMPACT; MFR: PANASONIC; MFR_PN: ERJ-2RKF7502X
R2 R6 = milliLearn-ice40:R0402_COMPACT; MFR: PANASONIC; MFR_PN: ERJ-2RKF2402X
R3 = milliLearn-ice40:R0402_COMPACT; MFR: PANASONIC; MFR_PN: ERJ-2RKF2002X
R4 = milliLearn-ice40:R0402_COMPACT; MFR: PANASONIC; MFR_PN: ERJ-2RKF1602X
R5 R8 R17 R33 = milliLearn-ice40:R0402_COMPACT; MFR: PANASONIC; MFR_PN: ERJ-2RKF1202X
R7 R10-R13 R18-R21 R26 R28 R29 R31 = milliLearn-ice40:R0402_COMPACT; MFR: PANASONIC; MFR_PN: ERJ-2RKF1002X
R9 = milliLearn-ice40:R0402_COMPACT; MFR: PANASONIC; MFR_PN: ERJ-2RKF2201X
R14 R15 R27 R36-R38 = milliLearn-ice40:R0402_COMPACT; MFR: PANASONIC; MFR_PN: ERJ-2RKF1001X
R16 R34 R35 = milliLearn-ice40:R0402_COMPACT; MFR: PANASONIC; MFR_PN: ERJ-2RKF4701X
R22-R24 R32 = rcl:R-US_: RESISTOR, American symbol; MFR: YAGEO; MFR_PN: RL0603FR-070R5L; SPICEPREFIX: R
R25 = milliLearn-ice40:R0402_COMPACT
R30 = milliLearn-ice40:R0402_COMPACT; MFR: PANASONIC; MFR_PN: ERJ-2RKF3002X
SJ1-SJ17 = SparkFun-Jumpers:JUMPER-SMT_2_NC_PASTE: Normally closed solder jumper This jumper has an aperture in the stencil to allow solder paste to bridge the split in the wire so it's normally closed (NC). Wick off the solder to open the connection. Reapply solder to reclose the connection.
SW1-SW3 = milliLearn-ice40:TE_FSMJSMA: Tactile Switch OFF-MOM, Surface Mount
U1 U3 U4 U10 = milliLearn-ice40:AP7366-W5-7; MFR: Diodes Inc; MFR_PN: AP7366-W5-7
U2 U11 = milliLearn-ice40:DSC6111CI2A-012.0000
U5 = gtjennings_pcb_121217_1200_release:MICROBUILDER_FT232H
U6 = milliLearn-ice40:MICROCHIP_93*76?: 8K Microwire Compatible Serial EEPROM Source: http://ww1.microchip.com/downloads/en/DeviceDoc/21796H.pdf; MF: MICROCHIP; MFR: MICROCHIP; MFR_PN: 93LC56BT-I/OT; MPN: 93LC76BT-I/OT; OC_FARNELL: 1556170; OC_NEWARK: 61H6848
U7 = milliLearn-ice40:MT25QL128ABA1EW7
U8 = milliLearn-ice40:ICE40UP5K/3K-SG48
U9 = milliLearn-ice40:INA4180A4IPWR; MFR: TI; MFR_PN: INA4180A4IPWR
U12 U13 = milliLearn-ice40:SPH0645LM4H-B; MFR: KNOWLES; MFR_PN: SPH0645LM4H-B